# Altium schematic sheet B0520.schdoc
size 49 x 29 mm
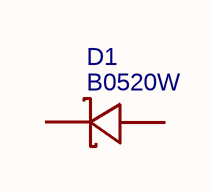
[diagram p0: B0520.schdoc]

## Parts
D1  B0520W  [SOD-123_L2.8-W1.8-LS3.7-RD]

## Nets

Not connected (* = marked no-connect by the designer): D1 1(C) 2(A)

## Library data of the parts
D1 = B0520W: BOM_Manufacturer: Shikues; Contributor: LCSC; BOM_Supplier: LCSC; BOM_Supplier Part: C475609; BOM_Manufacturer Part: B0520W; spicePre: D; spiceSymbolName: B0520W